# Altium schematic sheet PIC24_sensores_esquemático-temp.SchDoc
size 431 x 406 mm; SheetNumber: 1; SheetTotal: 1
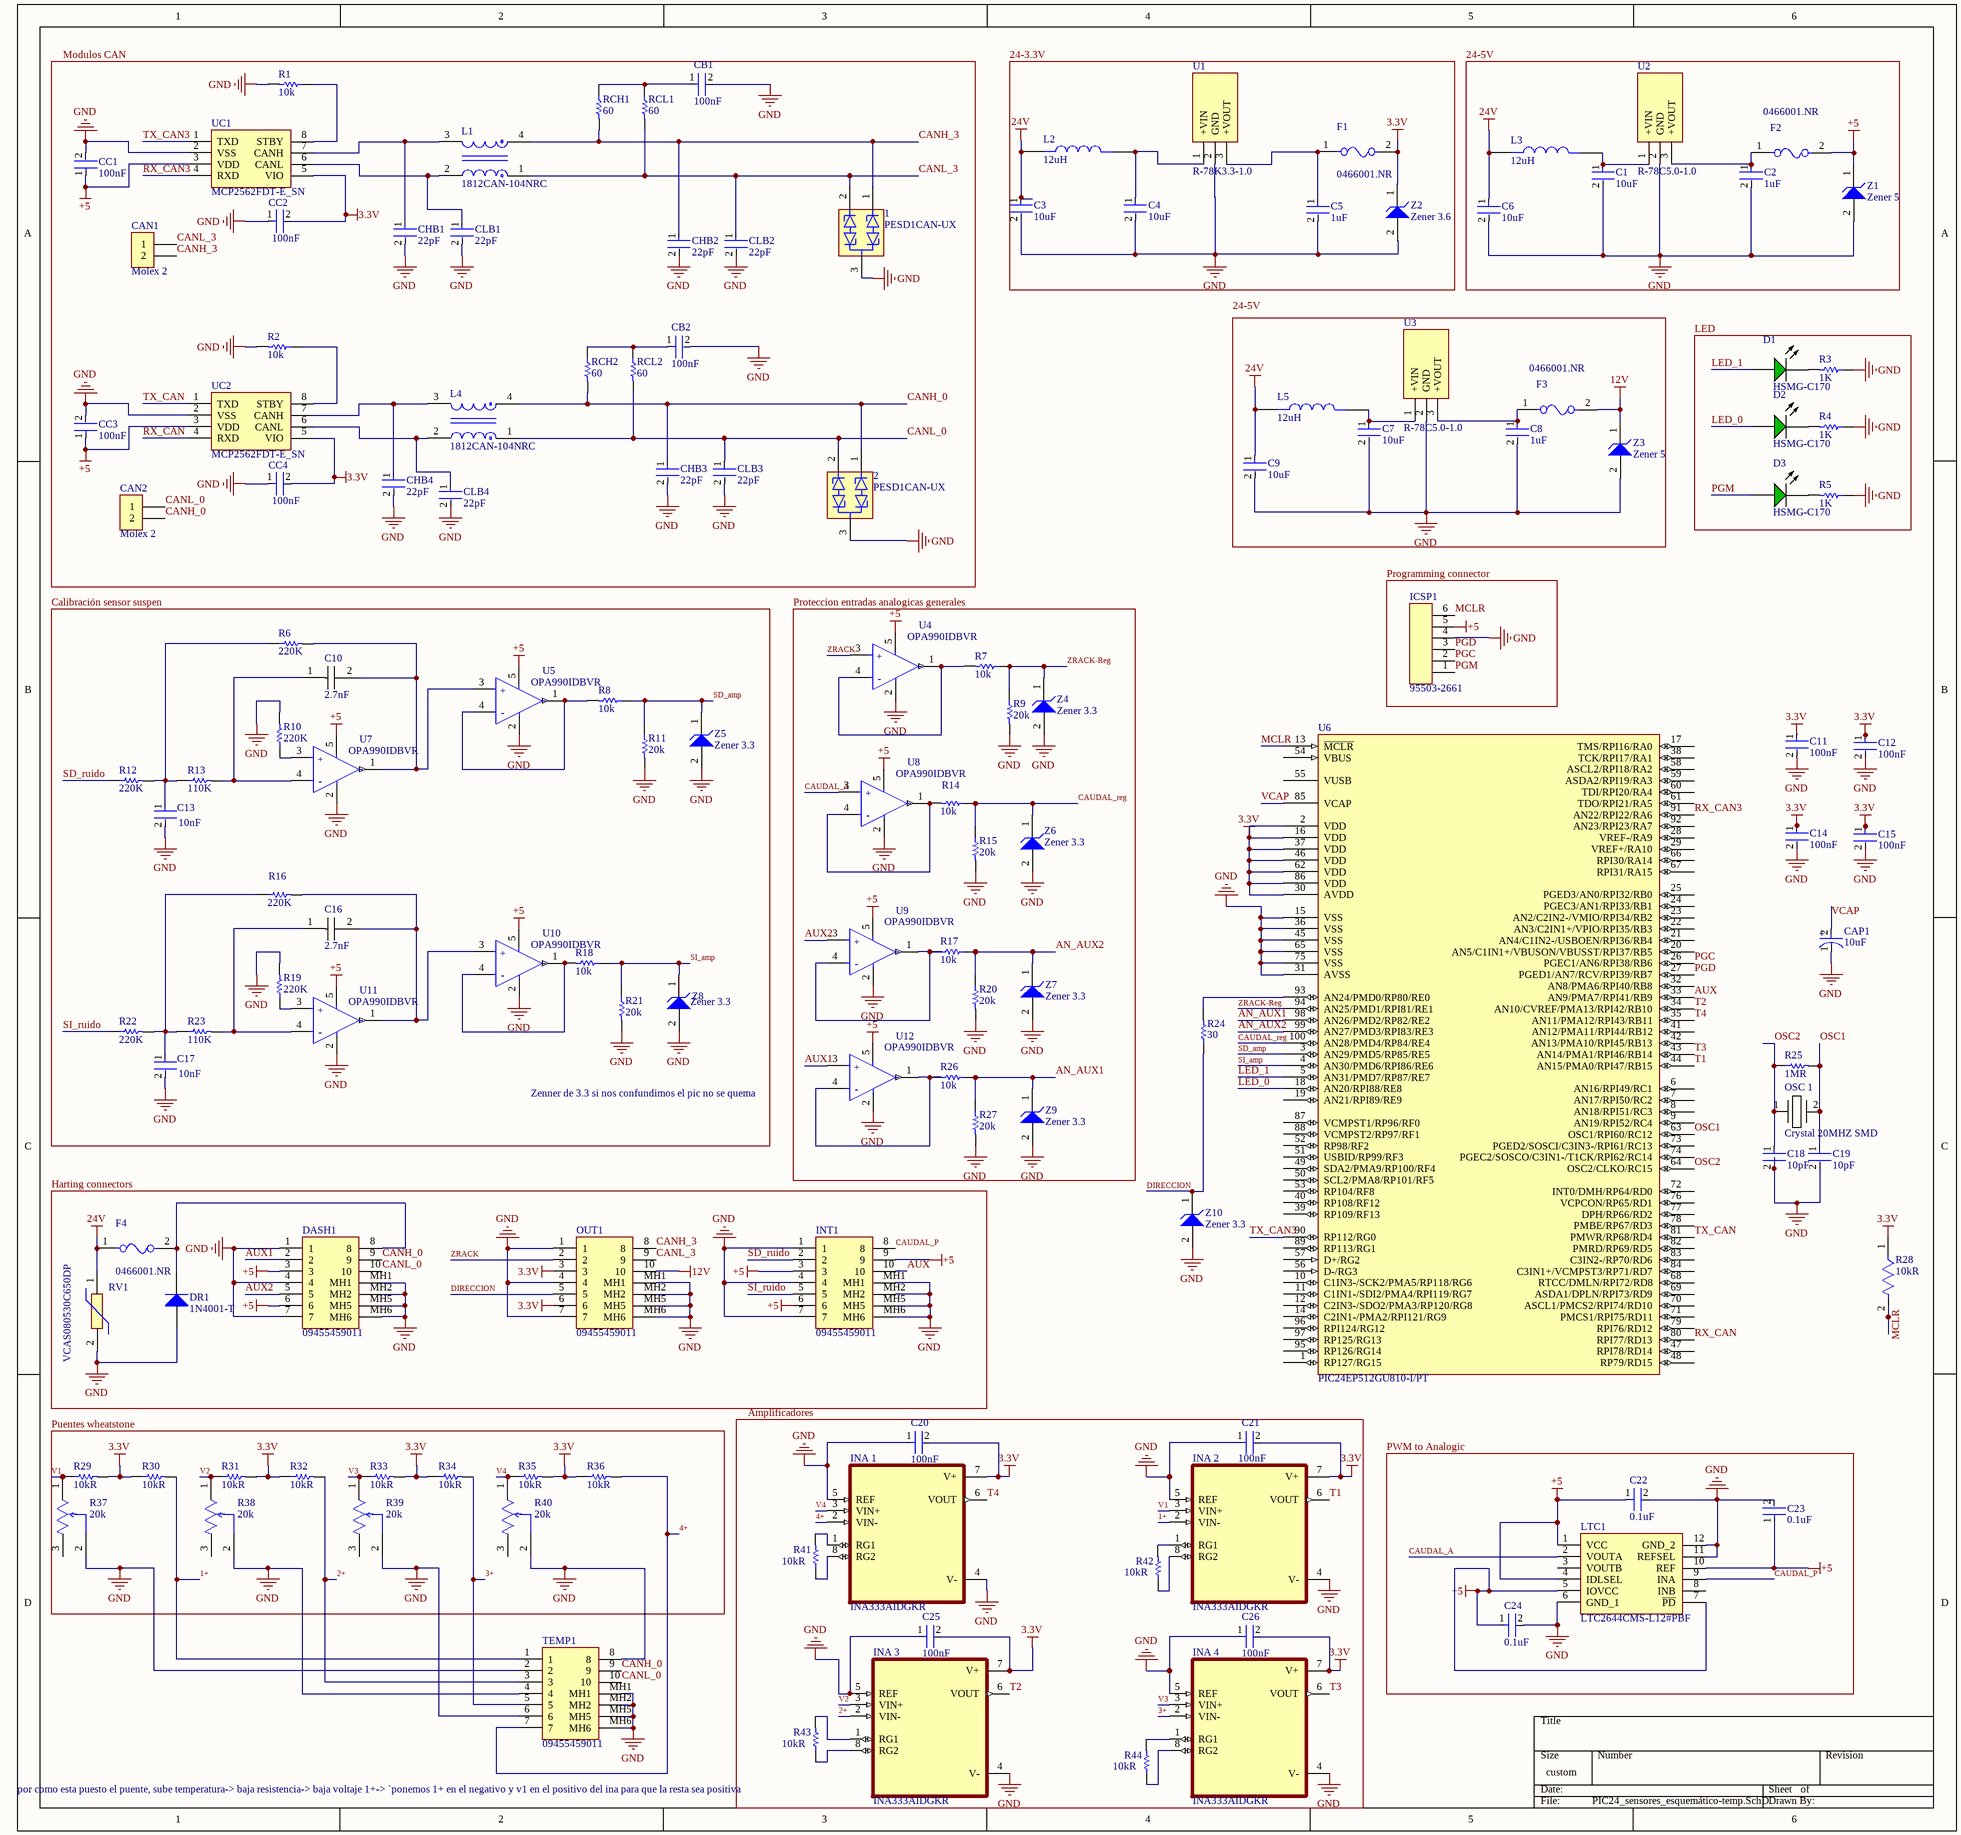
[diagram p0: PIC24_sensores_esquemático-temp.SchDoc]

## Parts
1  PESD1CAN-UX  [FP-SOT323-MFG]
2  PESD1CAN-UX  [FP-SOT323-MFG]
C1  value 10uF  [FP-CL21-IPC_B]  (hidden comment: CL21F105ZAFNNNF)
C2  value 1uF  [FP-CL21-IPC_B]  (hidden comment: CL21F105ZAFNNNF)
C3  value 10uF  [FP-CL21-IPC_B]  (hidden comment: CL21F105ZAFNNNF)
C4  value 10uF  [FP-CL21-IPC_B]  (hidden comment: CL21F105ZAFNNNF)
C5  value 1uF  [FP-CL21-IPC_B]  (hidden comment: CL21F105ZAFNNNF)
C6  value 10uF  [FP-CL21-IPC_B]  (hidden comment: CL21F105ZAFNNNF)
C7  value 10uF  [FP-CL21-IPC_B]  (hidden comment: CL21F105ZAFNNNF)
C8  value 1uF  [FP-CL21-IPC_B]  (hidden comment: CL21F105ZAFNNNF)
C9  value 10uF  [FP-CL21-IPC_B]  (hidden comment: CL21F105ZAFNNNF)
C10  2.7nF  [TMK212BJ105KG-T-Footprint-1]
C11  value 100nF  [FP-CL21-IPC_B]  (hidden comment: CL21F105ZAFNNNF)
C12  value 100nF  [FP-CL21-IPC_B]  (hidden comment: CL21F105ZAFNNNF)
C13  value 10nF  [FP-CL21-IPC_B]  (hidden comment: CL21F105ZAFNNNF)
C14  value 100nF  [FP-CL21-IPC_B]  (hidden comment: CL21F105ZAFNNNF)
C15  value 100nF  [FP-CL21-IPC_B]  (hidden comment: CL21F105ZAFNNNF)
C16  2.7nF  [TMK212BJ105KG-T-Footprint-1]
C17  value 10nF  [FP-CL21-IPC_B]  (hidden comment: CL21F105ZAFNNNF)
C18  value 10pF  [FP-CL21-IPC_B]  (hidden comment: CL21F105ZAFNNNF)
C19  value 10pF  [FP-CL21-IPC_B]  (hidden comment: CL21F105ZAFNNNF)
C20  value 100nF  [FP-CL21-IPC_B]  (hidden comment: CL21F105ZAFNNNF)
C21  value 100nF  [FP-CL21-IPC_B]  (hidden comment: CL21F105ZAFNNNF)
C22  value 0.1uF  [FP-CL21-IPC_B]  (hidden comment: CL21F105ZAFNNNF)
C23  value 0.1uF  [FP-CL21-IPC_B]  (hidden comment: CL21F105ZAFNNNF)
C24  value 0.1uF  [FP-CL21-IPC_B]  (hidden comment: CL21F105ZAFNNNF)
C25  value 100nF  [FP-CL21-IPC_B]  (hidden comment: CL21F105ZAFNNNF)
C26  value 100nF  [FP-CL21-IPC_B]  (hidden comment: CL21F105ZAFNNNF)
CAN1  Molex 2  [FP-43650-0228-MFG]
CAN2  Molex 2  [FP-43650-0228-MFG]
CAP1  10uF  [FP-T491B226K016AT-MFG]
CB1  value 100nF  [FP-CL21-IPC_B]  (hidden comment: CL21F105ZAFNNNF)
CB2  value 100nF  [FP-CL21-IPC_B]  (hidden comment: CL21F105ZAFNNNF)
CC1  value 100nF  [FP-CL21-IPC_B]  (hidden comment: CL21F105ZAFNNNF)
CC2  value 100nF  [FP-CL21-IPC_B]  (hidden comment: CL21F105ZAFNNNF)
CC3  value 100nF  [FP-CL21-IPC_B]  (hidden comment: CL21F105ZAFNNNF)
CC4  value 100nF  [FP-CL21-IPC_B]  (hidden comment: CL21F105ZAFNNNF)
CHB1  value 22pF  [FP-CL21-IPC_B]  (hidden comment: CL21F105ZAFNNNF)
CHB2  value 22pF  [FP-CL21-IPC_B]  (hidden comment: CL21F105ZAFNNNF)
CHB3  value 22pF  [FP-CL21-IPC_B]  (hidden comment: CL21F105ZAFNNNF)
CHB4  value 22pF  [FP-CL21-IPC_B]  (hidden comment: CL21F105ZAFNNNF)
CLB1  value 22pF  [FP-CL21-IPC_B]  (hidden comment: CL21F105ZAFNNNF)
CLB2  value 22pF  [FP-CL21-IPC_B]  (hidden comment: CL21F105ZAFNNNF)
CLB3  value 22pF  [FP-CL21-IPC_B]  (hidden comment: CL21F105ZAFNNNF)
CLB4  value 22pF  [FP-CL21-IPC_B]  (hidden comment: CL21F105ZAFNNNF)
D1  HSMG-C170  [AVAG-HSMX-C170_V]
D2  HSMG-C170  [AVAG-HSMX-C170_V]
D3  HSMG-C170  [AVAG-HSMX-C170_V]
DASH1  09455459011  [09455459011]
DR1  1N4001-T  [DIOD-DO-41-P-2_V]
F1  0466001.NR  [FP-0466-MFG]
F2  0466001.NR  [FP-0466-MFG]
F3  0466001.NR  [FP-0466-MFG]
F4  0466001.NR  [FP-0466-MFG]
ICSP1  95503-2661  [FP-95503-2661-MFG]
INA_1  INA333AIDGKR  [SOP65P490X110-8N]
INA_2  INA333AIDGKR  [SOP65P490X110-8N]
INA_3  INA333AIDGKR  [SOP65P490X110-8N]
INA_4  INA333AIDGKR  [SOP65P490X110-8N]
INT1  09455459011  [09455459011]
L1  1812CAN-104NRC  [FP-1812CAN-MFG]
L2  value 12uH  [IND_RLS-126]  (hidden comment: RLS-126)
L3  value 12uH  [IND_RLS-126]  (hidden comment: RLS-126)
L4  1812CAN-104NRC  [FP-1812CAN-MFG]
L5  value 12uH  [IND_RLS-126]  (hidden comment: RLS-126)
LTC1  LTC2644CMS-L12#PBF  [SOP65P490X110-12N]
OSC_1  Crystal 20MHZ SMD  [LFXTAL003181-Footprint-1]
OUT1  09455459011  [09455459011]
R1  value 10k  [RESC2013X60X35LL10T20]  (hidden comment: RC0805FR-0710KL)
R2  value 10k  [RESC2013X60X35LL10T20]  (hidden comment: RC0805FR-0710KL)
R3  value 1K  [RESC2013X60X35LL10T20]  (hidden comment: RC0805FR-0710KL)
R4  value 1K  [RESC2013X60X35LL10T20]  (hidden comment: RC0805FR-0710KL)
R5  value 1K  [RESC2013X60X35LL10T20]  (hidden comment: RC0805FR-0710KL)
R6  value 220K  [FP-MCU0805-MFG]  (hidden comment: MCU08050D1002BP100)
R7  value 10k  [RESC2013X60X35LL10T20]  (hidden comment: RC0805FR-0710KL)
R8  value 10k  [RESC2013X60X35LL10T20]  (hidden comment: RC0805FR-0710KL)
R9  value 20k  [RESC2013X60X35LL10T20]  (hidden comment: RC0805FR-0710KL)
R10  value 220K  [FP-MCU0805-MFG]  (hidden comment: MCU08050D1002BP100)
R11  value 20k  [RESC2013X60X35LL10T20]  (hidden comment: RC0805FR-0710KL)
R12  value 220K  [FP-MCU0805-MFG]  (hidden comment: MCU08050D1002BP100)
R13  value 110K  [FP-MCU0805-MFG]  (hidden comment: MCU08050D1002BP100)
R14  value 10k  [RESC2013X60X35LL10T20]  (hidden comment: RC0805FR-0710KL)
R15  value 20k  [RESC2013X60X35LL10T20]  (hidden comment: RC0805FR-0710KL)
R16  value 220K  [FP-MCU0805-MFG]  (hidden comment: MCU08050D1002BP100)
R17  value 10k  [RESC2013X60X35LL10T20]  (hidden comment: RC0805FR-0710KL)
R18  value 10k  [RESC2013X60X35LL10T20]  (hidden comment: RC0805FR-0710KL)
R19  value 220K  [FP-MCU0805-MFG]  (hidden comment: MCU08050D1002BP100)
R20  value 20k  [RESC2013X60X35LL10T20]  (hidden comment: RC0805FR-0710KL)
R21  value 20k  [RESC2013X60X35LL10T20]  (hidden comment: RC0805FR-0710KL)
R22  value 220K  [FP-MCU0805-MFG]  (hidden comment: MCU08050D1002BP100)
R23  value 110K  [FP-MCU0805-MFG]  (hidden comment: MCU08050D1002BP100)
R24  value 30  [RESC2013X60X35LL10T20]  (hidden comment: RC0805FR-0710KL)
R25  value 1MR  [RESC2013X60X35LL10T20]  (hidden comment: RC0805FR-0710KL)
R26  value 10k  [RESC2013X60X35LL10T20]  (hidden comment: RC0805FR-0710KL)
R27  value 20k  [RESC2013X60X35LL10T20]  (hidden comment: RC0805FR-0710KL)
R28  value 10kR  [FP-MCU0805-MFG]  (hidden comment: MCU08050D1002BP100)
R29  value 10kR  [RESC2013X60X35LL10T20]  (hidden comment: RC0805FR-0710KL)
R30  value 10kR  [RESC2013X60X35LL10T20]  (hidden comment: RC0805FR-0710KL)
R31  value 10kR  [RESC2013X60X35LL10T20]  (hidden comment: RC0805FR-0710KL)
R32  value 10kR  [RESC2013X60X35LL10T20]  (hidden comment: RC0805FR-0710KL)
R33  value 10kR  [RESC2013X60X35LL10T20]  (hidden comment: RC0805FR-0710KL)
R34  value 10kR  [RESC2013X60X35LL10T20]  (hidden comment: RC0805FR-0710KL)
R35  value 10kR  [RESC2013X60X35LL10T20]  (hidden comment: RC0805FR-0710KL)
R36  value 10kR  [RESC2013X60X35LL10T20]  (hidden comment: RC0805FR-0710KL)
R37  value 20k  [FP-3296W-MFG]  (hidden comment: 3296W-1-202LF)
R38  value 20k  [FP-3296W-MFG]  (hidden comment: 3296W-1-202LF)
R39  value 20k  [FP-3296W-MFG]  (hidden comment: 3296W-1-202LF)
R40  value 20k  [FP-3296W-MFG]  (hidden comment: 3296W-1-202LF)
R41  value 10kR  [RESC2013X60X35LL10T20]  (hidden comment: RC0805FR-0710KL)
R42  value 10kR  [RESC2013X60X35LL10T20]  (hidden comment: RC0805FR-0710KL)
R43  value 10kR  [RESC2013X60X35LL10T20]  (hidden comment: RC0805FR-0710KL)
R44  value 10kR  [RESC2013X60X35LL10T20]  (hidden comment: RC0805FR-0710KL)
RCH1  value 60  [RESC2013X60X35LL10T20]  (hidden comment: RC0805FR-0710KL)
RCH2  value 60  [RESC2013X60X35LL10T20]  (hidden comment: RC0805FR-0710KL)
RCL1  value 60  [RESC2013X60X35LL10T20]  (hidden comment: RC0805FR-0710KL)
RCL2  value 60  [RESC2013X60X35LL10T20]  (hidden comment: RC0805FR-0710KL)
RV1  VCAS080530C650DP  [VCAS080530C650DP-Footprint-1]
TEMP1  09455459011  [09455459011]
U1  R-78K3.3-1.0  [BGA81C100P9X9_1100X1100X350]
U2  R-78C5.0-1.0  [R-78C5.0-1.0-Footprint-1]
U3  R-78C5.0-1.0  [R-78C5.0-1.0-Footprint-1]
U4  OPA990IDBVR  [FP-DBV0005A-IPC_B]
U5  OPA990IDBVR  [FP-DBV0005A-IPC_B]
U6  PIC24EP512GU810-I/PT  [TQFP-PT100_L]
U7  OPA990IDBVR  [FP-DBV0005A-IPC_B]
U8  OPA990IDBVR  [FP-DBV0005A-IPC_B]
U9  OPA990IDBVR  [FP-DBV0005A-IPC_B]
U10  OPA990IDBVR  [FP-DBV0005A-IPC_B]
U11  OPA990IDBVR  [FP-DBV0005A-IPC_B]
U12  OPA990IDBVR  [FP-DBV0005A-IPC_B]
UC1  MCP2562FDT-E_SN  [SOIC127P600X175-8N]
UC2  MCP2562FDT-E_SN  [SOIC127P600X175-8N]
Z1  Zener 5  [ONSC-SOD-123-2-425-04_V]
Z2  Zener 3.6  [ONSC-SOD-123-2-425-04_V]
Z3  Zener 5  [ONSC-SOD-123-2-425-04_V]
Z4  Zener 3.3  [ONSC-SOD-123-2-425-04_V]
Z5  Zener 3.3  [ONSC-SOD-123-2-425-04_V]
Z6  Zener 3.3  [ONSC-SOD-123-2-425-04_V]
Z7  Zener 3.3  [ONSC-SOD-123-2-425-04_V]
Z8  Zener 3.3  [ONSC-SOD-123-2-425-04_V]
Z9  Zener 3.3  [ONSC-SOD-123-2-425-04_V]
Z10  Zener 3.3  [ONSC-SOD-123-2-425-04_V]

## Blocks framed on the sheet
Modulos CAN: 1 2 CAN1 CAN2 CB1 CB2 CC1-CC4 CHB1-CHB4 CLB1-CLB4 L1 L4 R1 R2 RCH1 RCH2 RCL1 RCL2 UC1 UC2
24-3.3V: C3-C5 F1 L2 U1 Z2
24-5V: C1 C2 C6 F2 L3 U2 Z1
24-5V: C7-C9 F3 L5 U3 Z3
LED: D1-D3 R3-R5
Proteccion entradas analogicas generales: R7 R9 R14 R15 R17 R20 R26 R27 U4 U8 U9 U12 Z4 Z6 Z7 Z9
Programming connector: ICSP1
Harting connectors: DASH1 DR1 F4 INT1 OUT1 RV1
Puentes wheatstone: R29-R40
Amplificadores: C20 C21 C25 C26 INA_1-INA_4 R41-R44
PWM to Analogic: C22-C24 LTC1

## Nets
3.3V: C11.1 C12.1 C14.1 C15.1 C20.2 C21.2 C25.2 C26.2 CC2.2 CC4.2 F1.2 INA_1.7(V+) INA_2.7(V+) INA_3.7(V+) INA_4.7(V+) OUT1.3 OUT1.6 R28.1 R29.2 R30.1 R31.2 R32.1 R33.2 R34.1 R35.2 R36.1 U6.2(VDD) U6.16(VDD) U6.30(AVDD) U6.37(VDD) U6.46(VDD) U6.62(VDD) U6.86(VDD) UC1.5(VIO) UC2.5(VIO) Z2.1(K)
12V: F3.2 OUT1.10 Z3.1(K)
24V: C3.1 C6.1 C9.1 F4.1 L2.1 L3.1 L5.1 RV1.1
+5: C22.1 C23.1 C24.1 CC1.1 CC3.1 DASH1.3 DASH1.6 F2.2 ICSP1.5 INT1.3 INT1.6 INT1.9 LTC1.1(VCC) LTC1.4(IDLSEL) LTC1.5(IOVCC) LTC1.7(~{PD}) LTC1.10(REF) U4.5(V+) U5.5(V+) U7.5(V+) U8.5(V+) U9.5(V+) U10.5(V+) U11.5(V+) U12.5(V+) UC1.3(VDD) UC2.3(VDD) Z1.1(K)
GND: 1.3(common_cathode) 2.3(common_cathode) C1.2 C2.2 C3.2 C4.2 C5.2 C6.2 C7.2 C8.2 C9.2 C11.2 C12.2 C13.2 C14.2 C15.2 C17.2 C18.2 C19.2 C20.1 C21.1 C22.2 C23.2 C24.2 C25.1 C26.1 CAP1.1(C) CB1.2 CB2.2 CC1.2 CC2.1 CC3.2 CC4.1 CHB1.2 CHB2.2 CHB3.2 CHB4.2 CLB1.2 CLB2.2 CLB3.2 CLB4.2 DASH1.1 DASH1.4 DASH1.7 DASH1.MH1 DASH1.MH2 DASH1.MH5 DASH1.MH6 DR1.1(A) ICSP1.4 INA_1.4(V-) INA_1.5(REF) INA_2.4(V-) INA_2.5(REF) INA_3.4(V-) INA_3.5(REF) INA_4.4(V-) INA_4.5(REF) INT1.1 INT1.4 INT1.7 INT1.MH1 INT1.MH2 INT1.MH5 INT1.MH6 LTC1.6(GND_1) LTC1.11(REFSEL) LTC1.12(GND_2) OUT1.1 OUT1.4 OUT1.7 OUT1.MH1 OUT1.MH2 OUT1.MH5 OUT1.MH6 R1.2 R2.2 R3.1 R4.1 R5.1 R9.2 R10.2 R11.2 R15.2 R19.2 R20.2 R21.2 R27.2 R37.2(WIPER) R38.2(WIPER) R39.2(WIPER) R40.2(WIPER) RV1.2 TEMP1.2 TEMP1.4 TEMP1.6 TEMP1.8 TEMP1.MH1 TEMP1.MH2 TEMP1.MH5 TEMP1.MH6 U1.2(GND) U2.2(GND) U3.2(GND) U4.2(V-) U5.2(V-) U6.15(VSS) U6.31(AVSS) U6.36(VSS) U6.45(VSS) U6.65(VSS) U6.75(VSS) U7.2(V-) U8.2(V-) U9.2(V-) U10.2(V-) U11.2(V-) U12.2(V-) UC1.2(VSS) UC2.2(VSS) Z1.2(A) Z2.2(A) Z3.2(A) Z4.2(A) Z5.2(A) Z6.2(A) Z7.2(A) Z8.2(A) Z9.2(A) Z10.2(A)
1+: INA_2.2(VIN-) R30.2 TEMP1.1
2+: INA_3.2(VIN-) R32.2 TEMP1.3
3+: INA_4.2(VIN-) R34.2 TEMP1.5
4+: INA_1.2(VIN-) R36.2 TEMP1.7
AN_AUX1: R26.1 R27.1 U6.98(AN26/PMD2/RP82/RE2) Z9.1(K)
AN_AUX2: R17.1 R20.1 U6.99(AN27/PMD3/RPI83/RE3) Z7.1(K)
AUX: INT1.10 U6.33(AN9/PMA7/RPI41/RB9)
AUX1: DASH1.2 U12.3(IN+)
AUX2: DASH1.5 U9.3(IN+)
CANH_0: 2.1(cathode_1) CAN2.2 CHB3.1 DASH1.9 L4.4 RCH2.2 TEMP1.9
CANH_3: 1.1(cathode_1) CAN1.2 CHB2.1 L1.4 OUT1.8 RCH1.2
CANL_0: 2.2(cathode_2) CAN2.1 CLB3.1 DASH1.10 L4.1 RCL2.2 TEMP1.10
CANL_3: 1.2(cathode_2) CAN1.1 CLB2.1 L1.1 OUT1.9 RCL1.2
CAUDAL_A: LTC1.2(VOUTA) U8.3(IN+)
CAUDAL_P: INT1.8 LTC1.9(INA)
CAUDAL_reg: R14.1 R15.1 U6.100(AN28/PMD4/RP84/RE4) Z6.1(K)
DIRECCION: OUT1.5 R24.1 Z10.1(K)
LED_0: D2.1(A) U6.18(AN20/RPI88/RE8)
LED_1: D1.1(A) U6.5(AN31/PMD7/RP87/RE7)
MCLR: ICSP1.6 R28.2 U6.13(~{MCLR})
OSC1: C19.1 OSC_1.2 R25.2 U6.63(OSC1/RPI60/RC12)
OSC2: C18.1 OSC_1.1 R25.1 U6.64(OSC2/CLKO/RC15)
PGC: ICSP1.2 U6.26(PGEC1/AN6/RPI38/RB6)
PGD: ICSP1.3 U6.27(PGED1/AN7/RCV/RPI39/RB7)
PGM: D3.1(A) ICSP1.1
RX_CAN: U6.80(RPI77/RD13) UC2.4(RXD)
RX_CAN3: U6.91(AN22/RPI22/RA6) UC1.4(RXD)
SD_amp: R8.1 R11.1 U6.3(AN29/PMD5/RP85/RE5) Z5.1(K)
SD_ruido: INT1.2 R12.1
SI_amp: R18.1 R21.1 U6.4(AN30/PMD6/RPI86/RE6) Z8.1(K)
SI_ruido: INT1.5 R22.1
T1: INA_2.6(VOUT) U6.44(AN15/PMA0/RPI47/RB15)
T2: INA_3.6(VOUT) U6.34(AN10/CVREF/PMA13/RPI42/RB10)
T3: INA_4.6(VOUT) U6.43(AN14/PMA1/RPI46/RB14)
T4: INA_1.6(VOUT) U6.35(AN11/PMA12/RPI43/RB11)
TX_CAN: U6.81(PMWR/RP68/RD4) UC2.1(TXD)
TX_CAN3: U6.90(RP112/RG0) UC1.1(TXD)
V1: INA_2.3(VIN+) R29.1 R37.1(CCW)
V2: INA_3.3(VIN+) R31.1 R38.1(CCW)
V3: INA_4.3(VIN+) R33.1 R39.1(CCW)
V4: INA_1.3(VIN+) R35.1 R40.1(CCW)
VCAP: CAP1.2(A) U6.85(VCAP)
ZRACK: OUT1.2 U4.3(IN+)
ZRACK-Reg: R7.1 R9.1 U6.94(AN25/PMD1/RPI81/RE1) Z4.1(K)
NetC1_1: C1.1 L3.2 U2.1(+VIN)
NetC2_1: C2.1 F2.1 U2.3(+VOUT)
NetC4_1: C4.1 L2.2 U1.1(+VIN)
NetC5_1: C5.1 F1.1 U1.3(+VOUT)
NetC7_1: C7.1 L5.2 U3.1(+VIN)
NetC8_1: C8.1 F3.1 U3.3(+VOUT)
NetC10_1: C10.1 R13.2 U7.4(IN-)
NetC10_2: C10.2 R6.2 U5.3(IN+) U7.1(OUT)
NetC13_1: C13.1 R6.1 R12.2 R13.1
NetC16_1: C16.1 R23.2 U11.4(IN-)
NetC16_2: C16.2 R16.2 U10.3(IN+) U11.1(OUT)
NetC17_1: C17.1 R16.1 R22.2 R23.1
NetCB1_1: CB1.1 RCH1.1 RCL1.1
NetCB2_1: CB2.1 RCH2.1 RCL2.1
NetCHB1_1: CHB1.1 L1.3 UC1.7(CANH)
NetCHB4_1: CHB4.1 L4.3 UC2.7(CANH)
NetCLB1_1: CLB1.1 L1.2 UC1.6(CANL)
NetCLB4_1: CLB4.1 L4.2 UC2.6(CANL)
NetD1_2: D1.2(K) R3.2
NetD2_2: D2.2(K) R4.2
NetD3_2: D3.2(K) R5.2
NetDASH1_8: DASH1.8 DR1.2(K) F4.2
NetINA_1_1: INA_1.1(RG1) R41.2
NetINA_1_8: INA_1.8(RG2) R41.1
NetINA_2_1: INA_2.1(RG1) R42.2
NetINA_2_8: INA_2.8(RG2) R42.1
NetINA_3_1: INA_3.1(RG1) R43.2
NetINA_3_8: INA_3.8(RG2) R43.1
NetINA_4_1: INA_4.1(RG1) R44.2
NetINA_4_8: INA_4.8(RG2) R44.1
NetR1_1: R1.1 UC1.8(STBY)
NetR2_1: R2.1 UC2.8(STBY)
NetR7_2: R7.2 U4.1(OUT) U4.4(IN-)
NetR8_2: R8.2 U5.1(OUT) U5.4(IN-)
NetR10_1: R10.1 U7.3(IN+)
NetR14_2: R14.2 U8.1(OUT) U8.4(IN-)
NetR17_2: R17.2 U9.1(OUT) U9.4(IN-)
NetR18_2: R18.2 U10.1(OUT) U10.4(IN-)
NetR19_1: R19.1 U11.3(IN+)
NetR24_2: R24.2 U6.93(AN24/PMD0/RP80/RE0)
NetR26_2: R26.2 U12.1(OUT) U12.4(IN-)

Not connected (* = marked no-connect by the designer): LTC1 3(VOUTB) 8(INB); R37 3(CW); R38 3(CW); R39 3(CW); R40 3(CW); U6 1(RP127/RG15) 6(AN16/RPI49/RC1) 7(AN17/RPI50/RC2) 8(AN18/RPI51/RC3) 9(AN19/RPI52/RC4) 10(C1IN3-/SCK2/PMA5/RP118/RG6) 11(C1IN1-/SDI2/PMA4/RPI119/RG7) 12(C2IN3-/SDO2/PMA3/RP120/RG8) 14(C2IN1-/PMA2/RPI121/RG9) 17(TMS/RPI16/RA0) 19(AN21/RPI89/RE9) 20(AN5/C1IN1+/VBUSON/VBUSST/RPI37/RB5) 21(AN4/C1IN2-/USBOEN/RPI36/RB4) 22(AN3/C2IN1+/VPIO/RPI35/RB3) 23(AN2/C2IN2-/VMIO/RPI34/RB2) 24(PGEC3/AN1/RPI33/RB1) 25(PGED3/AN0/RPI32/RB0) 28(VREF-/RA9) 29(VREF+/RA10) 32(AN8/PMA6/RPI40/RB8) 38(TCK/RPI17/RA1) 39(RP109/RF13) 40(RP108/RF12) 41(AN12/PMA11/RPI44/RB12) 42(AN13/PMA10/RPI45/RB13) 47(RPI78/RD14) 48(RP79/RD15) 49(SDA2/PMA9/RP100/RF4) 50(SCL2/PMA8/RP101/RF5) 51(USBID/RP99/RF3) 52(RP98/RF2) 53(RP104/RF8) 54(VBUS) 55(VUSB) 56(D-/RG3) 57(D+/RG2) 58(ASCL2/RPI18/RA2) 59(ASDA2/RPI19/RA3) 60(TDI/RPI20/RA4) 61(TDO/RPI21/RA5) 66(RPI30/RA14) 67(RPI31/RA15) 68(RTCC/DMLN/RPI72/RD8) 69(ASDA1/DPLN/RPI73/RD9) 70(ASCL1/PMCS2/RPI74/RD10) 71(PMCS1/RPI75/RD11) 72(INT0/DMH/RP64/RD0) 73(PGED2/SOSCI/C3IN3-/RPI61/RC13) 74(PGEC2/SOSCO/C3IN1-/T1CK/RPI62/RC14) 76(VCPCON/RP65/RD1) 77(DPH/RP66/RD2) 78(PMBE/RP67/RD3) 79(RPI76/RD12) 82(PMRD/RP69/RD5) 83(C3IN2-/RP70/RD6) 84(C3IN1+/VCMPST3/RP71/RD7) 87(VCMPST1/RP96/RF0) 88(VCMPST2/RP97/RF1) 89(RP113/RG1) 92(AN23/RPI23/RA7) 95(RP126/RG14) 96(RPI124/RG12) 97(RP125/RG13)

## Notes on the sheet
- Calibración sensor suspen
- Zenner de 3.3 si nos confundimos el pic no se quema
- (near INA_3) por como esta puesto el puente, sube temperatura-> baja resistencia-> baja voltaje 1+-> `ponemos 1+ en el negativo y v1 en el positivo del ina para que la resta sea positiva
- (in symbol CMP-014-00006-1) +; -
- (in symbol CMP-03017-000029-1) +

## Library data of the parts
1 2 = CMP-004-00011-5: PESD1CAN Series 50 V 9.3 pF SMT CAN bus ESD Protection Diode - SOT-323
C1-C9 C11-C15 C17-C26 CB1 CB2 CC1-CC4 CHB1-CHB4 CLB1-CLB4 = CMP-001-00000-1: Cap Ceramic 1uF 25V Y5V -20% to 80% SMD 0805 85°C Embossed T/R; Length: 2mm; Dielectric: Y5V; Width: 0.049inch; Series: CL; Voltage Rating: 25V; Depth: 1.25mm; Voltage Rating (DC): 25V; Case/Package: 0805; Mounting Technology: Surface Mount; RoHS Compliant: Yes; Construction: Flat; Min Operating Temperature: -30°C; Radiation Hardening: No; Package Quantity: 10000; Max Operating Temperature: 85°C; Tolerance: 80%; Thickness: 0.053inch; Height: 1.25mm; Packaging: Tape and Reel
C10 C16 = CMP-000010-1: 0805 1 uF 25 V ±10 % X5R Surface Mount Multilayer Ceramic Capacitor; Value: 1uF; Voltage Rating (DC): 25V; Tolerance: 10%; Min Operating Temperature: -55°C; Mounting Technology: Surface Mount; Packaging: Tape and Reel; Height: 1.25mm; Construction: Flat; Reach SVHC Compliant: Unknown; Package Quantity: 3000; Depth: 1.25mm; Max Operating Temperature: 85°C; Case/Package: 0805; Lead Free: Lead Free; Voltage Rating: 25V; Series: M; RoHS Compliant: Yes; Pins: 2; Case Code (Metric): 2012; Termination: SMD/SMT; Width: 1.25mm; Dielectric: X5R; Radiation Hardening: No; Case Code (Imperial): 0805; Length: 2mm
CAN1 CAN2 = CMP-001-0009-12: Conn Wire to Board HDR 2 POS 3mm Solder ST Top Entry Thru-Hole Tray; Voltage Rating: 250V; Glow Wire Compliant: Compliant; Number of Circuits: 2; Current Rating: 5A; Termination: Through Hole; Housing Material: Thermoplastic; Pitch: 3mm; Package Quantity: 3264; Series: 43650; Contact Material: Brass; Number of Rows: 1; Orientation: Vertical; RoHS Compliant: Yes; Contact Plating: Gold; Halogen Free: Low Halogen; Number of Positions: 2; Packaging: Tray
CAP1 = CMP-03017-000029-1: CAP TANT 22UF 10% 16V 1411; Polarity: Polar; Dissipation Factor: 6%; Dielectric Material: Tantalum; ESR (Equivalent Series Resistance): 2.2R; Life (Hours): 2000Hour; Leakage Current: 3.6uA; Radiation Hardening: No; Min Operating Temperature: -55°C; Packaging: Tape and Reel; Tolerance: 10%; Case Code (Imperial): 1411; Package Quantity: 1; Width: 2.8mm; Termination: SMD/SMT; Lead Free: Lead Free; Features: General Purpose; Capacitance: 22uF; Case/Package: 1411; Mount: Surface Mount; Voltage Rating (DC): 16V; Depth: 2.8mm; Height - Seated (Max): 0.083inch; Voltage Rating: 16V; Number of Pins: 2; Lead Pitch: 1.9mm; RoHS Compliant: Yes; Failure Rate: 0.001%; Height: 1.9mm; Voltage: 16V; Case Code (Metric): 3528; Max Operating Temperature: 125°C; Length: 3.5mm; Weight: 0.002293oz; REACH SVHC: No SVHC
D1-D3 = CMP-007-00000-1: Led 570NM Green Diff 0805 SMD; Number of LEDs: 1; Dominant Wavelength: 572nm; Color: Green,Yellow; Test Current: 20mA; Luminous Intensity: 15mcd; Reverse Voltage: 5V; Forward Voltage: 2.2V; Power Dissipation: 52mW; Lens Color: White; Lens Transparency: Diffused; Lens Style: Rectangular,Diffused,Colorless; Viewing Angle: 170°; Mounting Technology: Surface Mount; Min Operating Temperature: -30°C; Max Operating Temperature: 85°C; Length: 2mm; Lead Free: Lead Free; Case Code (Imperial): 0805; RoHS Compliant: Yes; Case/Package: 0805; Case Code (Metric): 2012; Width: 1.25mm; Height: 0.8mm; Forward Current: 20mA; Package Quantity: 4000; Pins: 2; Radiation Hardening: No; Number of Elements: 1; Reach SVHC Compliant: No; Series: -; Illumination Color: Green; Power Rating: 52mW; Packaging: Tape and Reel; Depth: 1.25mm; Wavelength: 572nm
DASH1 INT1 OUT1 TEMP1 = CMP-002-00003-3: Harting Pushpull V4 Signal, 10Pins, Panel Side Insert For Angled Solder Termination
DR1 = CMP-004-00000-1: Diode Standard Recovery Rectifier 50V 1A 2-Pin DO-41 T/R; Max Surge Current: 30A; Recovery Time: 2us; Forward Voltage: 1V; Value: 15pF; Max Reverse Current: 5uA; Termination: Through Hole; Diameter: 2.72mm; Contact Plating: Tin; Max Operating Temperature: 150°C; Height: 2.71mm; Max Repetitive Reverse Voltage (Vrrm): 50V; Lead Free: Lead Free; Series: -; Peak Non-Repetitive Surge Current: 30A; Pins: 2; Packaging: Tape and Reel; Current Rating: 1A; Average Rectified Current: 1A; Min Operating Temperature: -65°C; Width: 2.71mm; Case/Package: DO-41; Polarity: Standard; Max Reverse Voltage (DC): 50V; Output Current: 1A; Length: 4.7mm; RoHS Compliant: Yes; Forward Current: 1A; Max Forward Surge Current (Ifsm): 30A; Package Quantity: 5000; Weight: 0.010582oz; Reverse Voltage (DC): 50V; Radiation Hardening: No; Reach SVHC Compliant: No; Voltage Rating (DC): 50V
F1-F4 = CMP-005-00001-1: Fuse Chip Very Fast Acting 1A 63V SMD Solder Pad 1206 T/R CSA; Value: 72mR; Approvals: UL,CSA; Fuse Type: Board Mount (Cartridge Style Excluded); DC Cold Resistance: 76mR; Max Operating Temperature: 90°C; Fuse Current: 1A; Min Operating Temperature: -55°C; Housing Material: Ceramic; Radiation Hardening: No; Packaging: Tape and Reel; Lead Free: Lead Free; Depth: 1.52mm; Series: 466; Case/Package: 1206; Width: 1.52mm; Voltage Rating (AC): 63V; Case Code (Imperial): 1206; Reach SVHC Compliant: No; Voltage Rating: 63V; Terminal Material: Copper; Working Voltage: 63V; Pins: 2; Mounting Technology: Surface Mount; Voltage Rating (DC): 63V; Package Quantity: 5000; Length: 3.18mm; Case Code (Metric): 3216; Current Rating: 1A; RoHS Compliant: Yes; Height: 0.023inch
ICSP1 = CMP-001-0019-1: Modular Jack, Vertical, Top Entry, Through Hole, 6/6, No Key Version, Tray; Max Voltage Rating (DC): 125V; Number of Ports: 1; Shielding: Unshielded; Number of Positions Loaded: 6; Gender: Female; Pitch: 2.54mm; Current Rating: 1.5A; Mounting Technology: Through Hole; Series: 95503; Termination: Through Hole; Depth: 15.08mm; Packaging: Tray; Length: 13.21mm; Housing Material: Thermoplastic; RoHS Compliant: Yes; Number of Ways: 6; Package Quantity: 3094; Halogen Free: Low Halogen; Contact Plating: Gold; Contact Material: Copper Alloy,Brass,Gold; Width: 13.21mm; Orientation: Straight; Min Operating Temperature: -40°C; Housing Color: Black; Max Operating Temperature: 80°C; Number of Contacts: 6; Number of Positions: 6; Color: Black; Voltage Rating (DC): 125V; Reach SVHC Compliant: Unknown; Voltage Rating: 125V
INA_1-INA_4 = CMP-077-000000-1: Low-Power, Zero-Drift, Precision Instrumentation Amplifier 8-VSSOP -40 to 125; MF: Texas Instruments; Design Item ID: INA333AIDGKR; Mouser-Purchase-URL: https://snapeda.com/shop?store=Mouser&id=53142; DigiKey-Purchase-URL: https://snapeda.com/shop?store=DigiKey&id=53142; MP: INA333AIDGKR; Package: VSSOP-8 Texas Instruments; Texas_Instruments-Purchase-URL: https://snapeda.com/shop?store=Texas+Instruments&id=53142; SnapEDA_Link: https://www.snapeda.com/parts/INA333AIDGKR/Texas%20Instruments/view-part/53142/?ref=snap; Component Type: Standard; Value: *; Digi-Key_Part_Number: 296-23564-1-ND; Pin Count: 8; Source: INA333AIDGKR.SchLib
L1 L4 = CMP-000005-4: Common Mode Choke, 30% tol, SMT, RoHS, halogen-free; pin to pad: 1>2 2>1 3>4 4>3; RoHS Compliant: Yes
L2 L3 L5 = CMP-036-000000-1: Line Inductors for RECOM Power Supply; Package: 1812 Recom Power; MF: Recom Power; Source: SnapEDAsch.SchLib; SnapEDA_Link: https://www.snapeda.com/parts/RLS-126/Recom%20Power/view-part/3594564/?ref=snap; Availability: Unavailable; Design Item ID: RLS-126; MP: RLS-126; Pin Count: 2; Price: None; Component Type: Standard
LTC1 = LTC2644CMS-L12#PBF: Integrated Circuit; Manufacturer_Name: Analog Devices; Datasheet Link: https://www.analog.com/media/en/technical-documentation/data-sheets/2644fa.pdf; Height: 1.1mm; Manufacturer_Part_Number: LTC2644CMS-L12#PBF; Mouser Part Number: 584-C2644CMS-L12PBF; Mouser Price/Stock: https://www.mouser.co.uk/ProductDetail/Analog-Devices/LTC2644CMS-L12PBF?qs=hVkxg5c3xu80urzBoeNBsQ%3D%3D; Arrow Part Number: LTC2644CMS-L12#PBF; Arrow Price/Stock: https://www.arrow.com/en/products/ltc2644cms-l12pbf/analog-devices
OSC_1 = CMP-003-00000-3: LFXTAL003181 - Crystal 20MHZ 16PF 2-PIN HC-49/4H Smx Bulk; Frequency Tolerance: 30ppm; ESR: 50R; Frequency Stability: 50ppm; Min Operating Temperature: -10°C; Frequency: 20MHz; Load Capacitance: 16pF; Pins: 2; Packaging: Tape and Reel; Width: 4.7mm; Mounting Technology: Surface Mount; Series: HC49/4H SMX; Height: 4mm; Max Operating Temperature: 60°C; Reach SVHC Compliant: No; Length: 11.05mm; Size: 4.3mm
R1-R5 R7-R9 R11 R14 R15 R17 R18 R20 R21 R24-R27 R29-R36 R41-R44 RCH1 RCH2 RCL1 RCL2 = CMP-009-00000-1: SMD Chip Resistor, 10 kOhm, ± 1%, 125 mW, 0805 [2012 Metric], Thick Film, General Purpose; Power Rating: 125mW; Voltage Rating: 150V; Temperature Coefficient: 100ppm/°C; Height: 0.024inch; Military Standard: Not; Termination: SMD/SMT; Tolerance: 1%; Lead Free: Lead Free; Number of Terminations: 2; Reach SVHC Compliant: Unknown; Package Quantity: 1; Features: Moisture Resistant; Resistance Tolerance: 1%; RoHS Compliant: Yes; Resistor Type: Thick Film; Case Code (Metric): 2012; Width: 0.049inch; Series: RC; Packaging: Tape and Reel; Case Code (Imperial): 0805; Construction: Rectangular; Max Power Dissipation: 125mW; Depth: 1.25mm; Case/Package: 0805; Length: 0.079inch; Technology: THICK FILM; Max Operating Temperature: 155°C; Min Operating Temperature: -55°C
R6 R10 R12 R13 R16 R19 R22 R23 = CMP-009-00016-2: SMD Chip Resistor, 10 kOhm, ± 0.1%, 125 mW, 0805 [2012 Metric], Thin Film, Precision; Temperature Coefficient: 25ppm/°C; Max Power Dissipation: 125mW; Voltage Rating: 150V; Voltage Rating (DC): 100V; Case/Package: 0805; Package Quantity: 1000; Tolerance: 0.1%; Height: 0.022inch; Packaging: Tape and Reel; Series: MCU 0805 - Precision; Min Operating Temperature: -55°C; Width: 0.049inch; Number of Terminations: 2; Contact Plating: Tin; Radiation Hardening: No; Max Operating Temperature: 125°C; RoHS Compliant: Yes; Length: 0.079inch; Lead Free: Lead Free
R28 = CMP-009-00016-1: SMD Chip Resistor, 10 kOhm, ± 0.1%, 125 mW, 0805 [2012 Metric], Thin Film, Precision; Temperature Coefficient: 25ppm/°C; Voltage Rating (DC): 100V; Voltage Rating: 150V; Max Power Dissipation: 125mW; Tolerance: 0.1%; Contact Plating: Tin; Height: 0.022inch; Series: MCU 0805 - Precision; Number of Terminations: 2; Lead Free: Lead Free; Case/Package: 0805; Packaging: Tape and Reel; Width: 0.049inch; Length: 0.079inch; Max Operating Temperature: 125°C; Package Quantity: 1000; Radiation Hardening: No; Min Operating Temperature: -55°C; RoHS Compliant: Yes
R37-R40 = CMP-009-00006-1: Trimmer Potentiometer 2k Ohm 10% 1/2 Watt 25 Turn 2.19mm Pin Through Hole; Max Power Dissipation: 500mW; Temperature Coefficient: 100ppm/°C; Voltage Rating (AC): 300V; Number of Turns: 25; Radiation Hardening: No; Termination: Pin; Taper: Linear; Series: 3296; Mounting Technology: Through Hole,Panel,PCB; Max Operating Temperature: 125°C; Power Rating: 500mW; Color: Blue; Lead Free: Lead Free; Height: 11.55mm; Weight: 0.03oz; Resistor Type: Cermet; Packaging: Rail/Tube; Military Standard: Not; RoHS Compliant: Yes; Min Operating Temperature: -55°C; Length: 9.53mm; Resistance Tolerance: 10%; Width: 9.53mm; Tolerance: 10%; Depth: 4.83mm; Reach SVHC Compliant: No; Technology: CERMET
RV1 = CMP-00000-4: Varistor, 67V, 21Vac, 30Vdc, 0805; Max Varistor Voltage: 45.1V; Max Voltage Rating (AC): 21V; Number of Circuits: 1; Voltage Rating (DC): 30V; Clamping Current: 1A; Energy: 0.3J; Max Surge Current: 80A; Value: 250pF; Min Varistor Voltage: 36.9V; Tolerance: 10%; Varistor Voltage: 41V; RoHS Compliant: Yes; Case/Package: 0805; Mounting Technology: Surface Mount; Max Voltage Rating (DC): 30V; Clamping Voltage: 67V; Series: TransGuard®; Max Operating Temperature: 125°C; Width: 1.25mm; Termination: SMD/SMT; Case Code (Imperial): 0805; Min Operating Temperature: -55°C; Case Code (Metric): 2012; Packaging: Tape and Reel; Reach SVHC Compliant: No; Package Quantity: 1000; Voltage Rating (AC): 21V
U1 = CMP-000080-1: R-78K-1.0 Series Single Output 3.3 V 1 A Non Isolated DC/DC Converter - SIP-3
U2 U3 = CMP-000001-5: 1A DC/DC-Converter 'INNOLINE' SIP3 reg; V. In: 8-42; V. Out: 5.0; mA. Out: 1000; Min Input Voltage (DC): 8V; Output Voltage: 5V; Max Output Power: 5W; Number of Outputs: 1; Max Input Voltage (DC): 42V; Pitch: 2.54mm; Efficiency: 93%; Length: 11.6mm; Reach SVHC Compliant: No; Height: 10.4mm; Package Quantity: 42; Pins: 3; Mounting Technology: Through Hole,PCB; Min Input Voltage: 8V; Output Current: 1A; Lead Free: Lead Free; Max Power Dissipation: 5W; Nominal Output Voltage: 5V; RoHS Compliant: Yes; Max Output Voltage: 5V; Max Output current: 1A; Depth: 11.6mm; Features: OTP,SCP; Voltage - Output 1: 5V; Output Power: 5W; Series: INNOLINE R-78C-1.0; Current - Output 1: 1A; Max Supply Voltage: 42V; Max Operating Temperature: 85°C; Min Operating Temperature: -40°C; Power Rating: 5W; Weight: 2g; Packaging: Rail/Tube; Width: 8.5mm
U4 U5 U7-U12 = CMP-014-00006-1: Single 1MHz, 40-V rail-to-rail input/output, low-offset-voltage, low-power op amp 5-SOT-23 -40 to 125
U6 = CMP-0232-00012-1: General Purpose 16-bit Microcontroller with USB, Enhanced Performance Flash Memory, 512 KB Program Memory, 100-Pin TQFP (PT), Industrial Temperature; PackageReference: TQFP-PT100; DatasheetVersion: Aug-2011; ComponentLink1Description: Datasheet; ComponentLink3URL: http://www.microchip.com/; PackageDescription: 100-Lead Plastic Thin Quad Flatpack (PT) - 12x12x1mm Body, 2.00mm [TQFP]; ComponentLink2Description: Packaging Specification; ComponentLink3Description: Microchip.com Home; ComponentLink1URL: http://ww1.microchip.com/downloads/en/DeviceDoc/70616E.pdf; ComponentLink2URL: http://www.microchip.com/stellent/groups/techpub_sg/documents/packagingspec/en012702.pdf; PackageVersion: revBB, Aug-2009
UC1 UC2 = MCP2562FDT-E_SN: Integrated Circuit; Manufacturer_Name: Microchip; Manufacturer_Part_Number: MCP2562FDT-E/SN; Datasheet Link: https://ww1.microchip.com/downloads/en/DeviceDoc/20005284A.pdf; Height: 1.75mm; Mouser Part Number: 579-MCP2562FDT-E/SN; Mouser Price/Stock: https://www.mouser.co.uk/ProductDetail/Microchip-Technology/MCP2562FDT-E-SN?qs=YlpJWyuQ3PNwRkBGVHsNkA%3D%3D; Arrow Part Number: MCP2562FDT-E/SN; Arrow Price/Stock: https://www.arrow.com/en/products/mcp2562fdt-esn/microchip-technology?utm_currency=USD&region=nac
Z1-Z10 = CMP-004-00007-2: Diode Zener Single 3.6V 5% 500mW Automotive 2-Pin SOD-123 T/R; Test Current: 50uA; Working Voltage: 20V; Forward Voltage: 900mV; Max Reverse Current: 50nA; Max Reverse Leakage Current: 7.5uA; Max Operating Temperature: 150°C; Zener Voltage: 3.6V; Reach SVHC Compliant: No; Lead Free: Lead Free; Height: 1.25mm; Zener Current: 50uA; Length: 2.84mm; Packaging: Tape and Reel; Package Quantity: 3000; Min Operating Temperature: -55°C; RoHS Compliant: Yes; Tolerance: 5%; Series: -; Width: 1.8mm; Voltage Tolerance: 5%; Pins: 2; Case/Package: SOD-123-2; Radiation Hardening: No; Max Power Dissipation: 500mW; Power Dissipation: 500mW; Power Rating: 500mW; Voltage Rating (DC): 20V